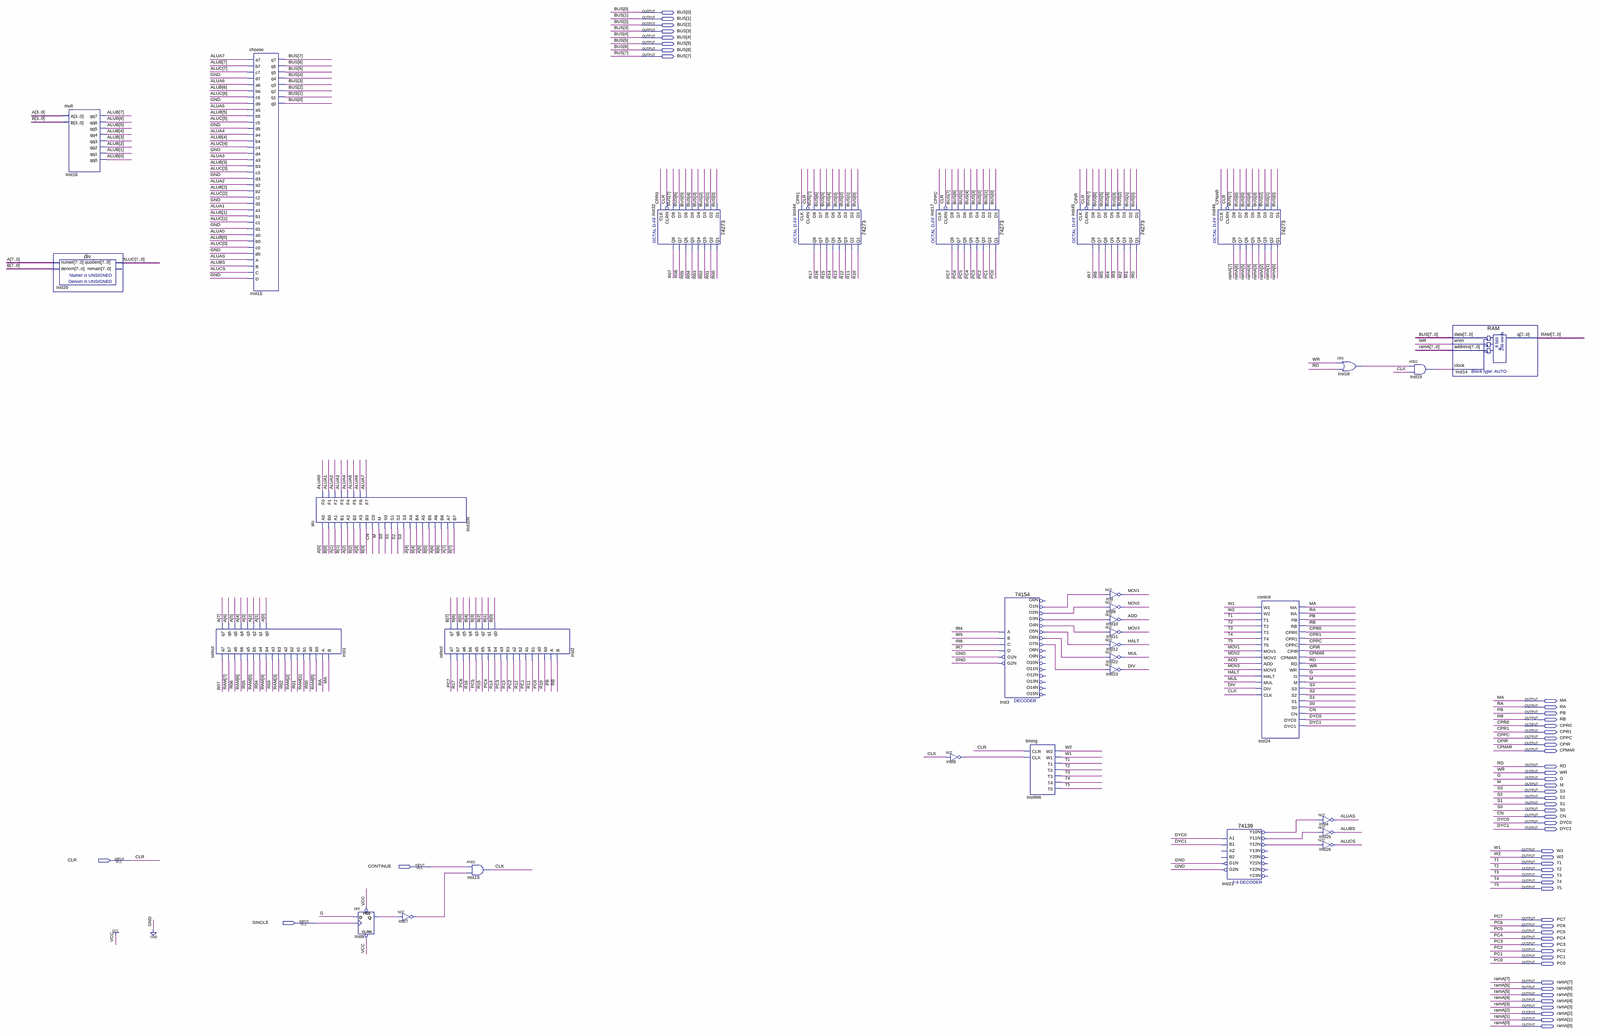
[diagram p0: schematic sheet, whole]
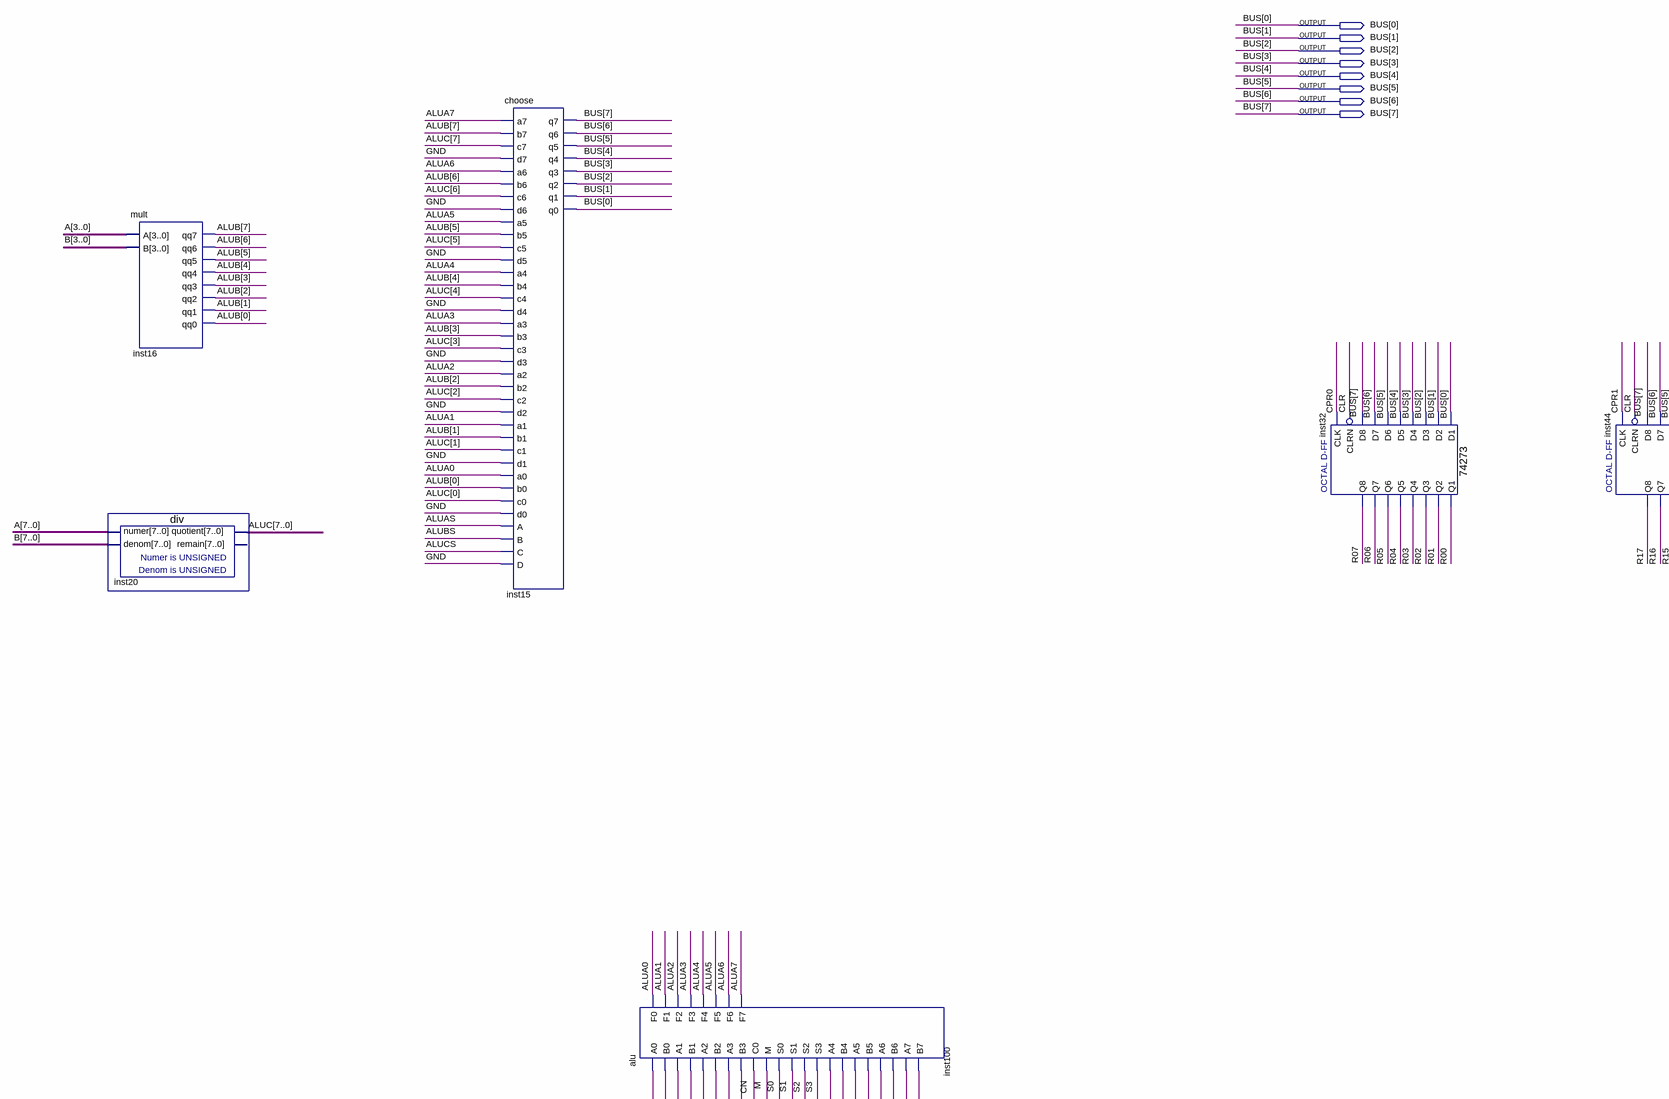
[diagram p1: schematic sheet, upper left part]
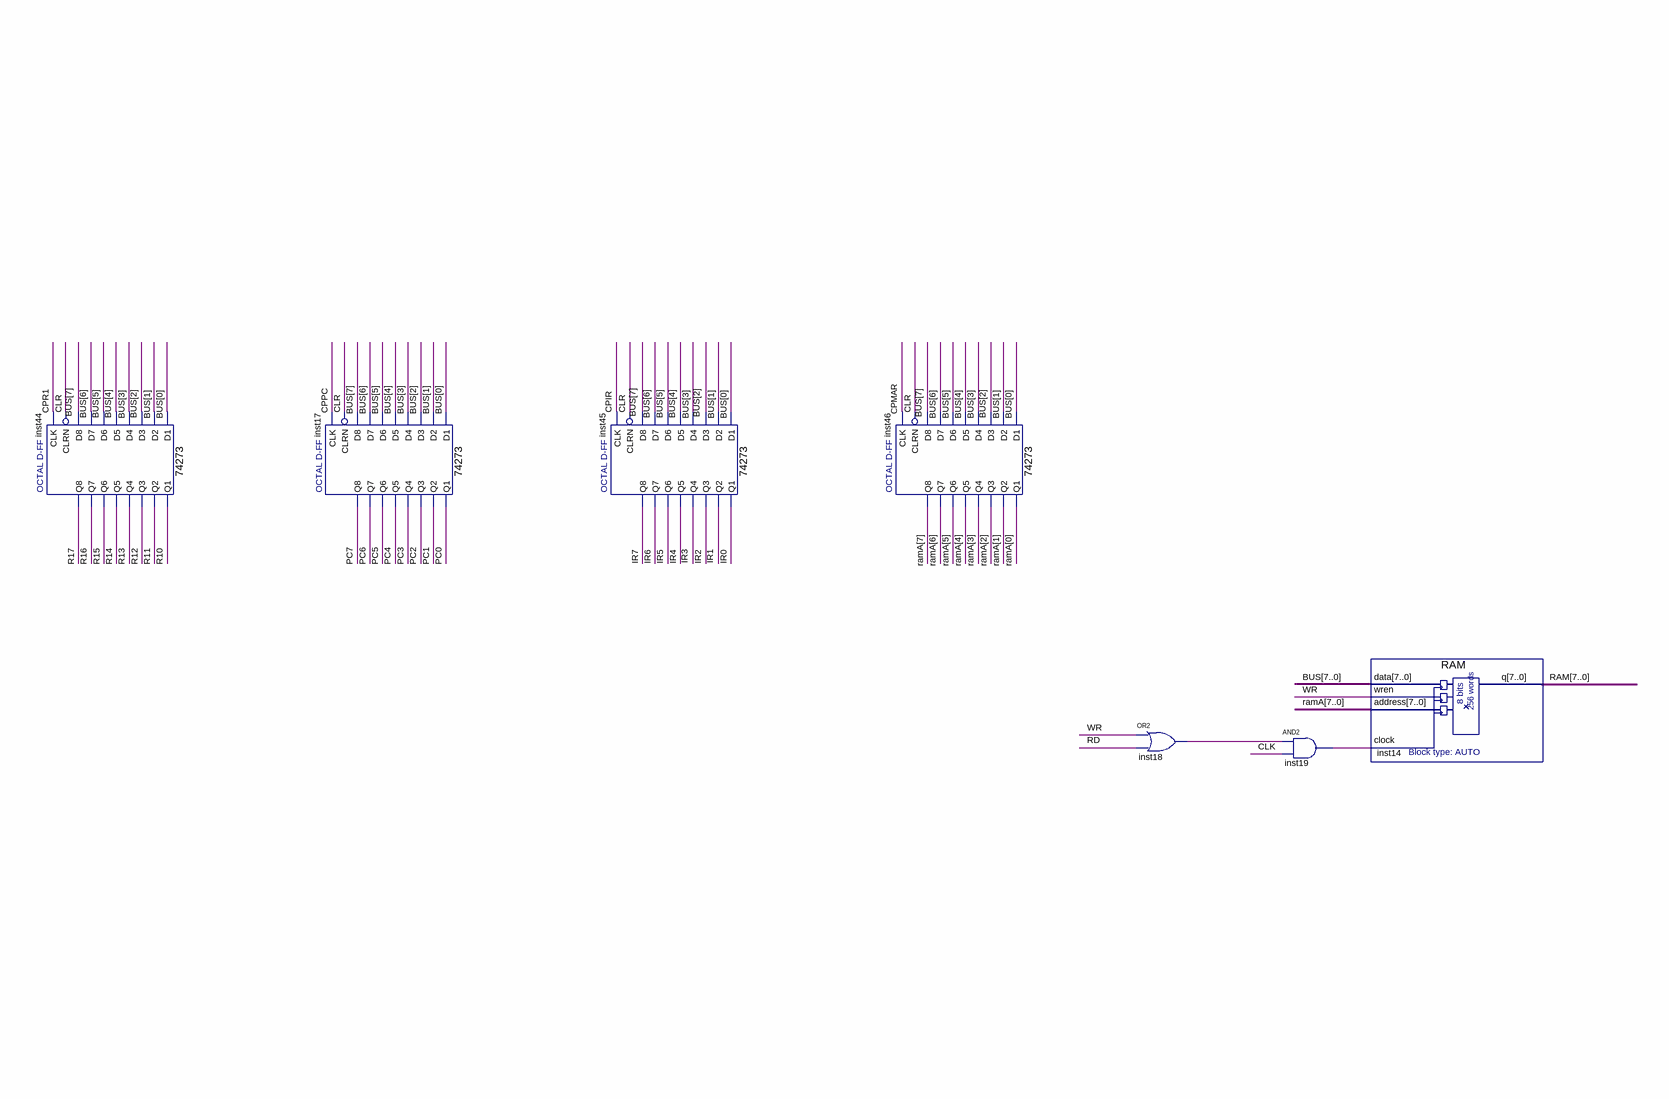
[diagram p2: schematic sheet, upper right part]
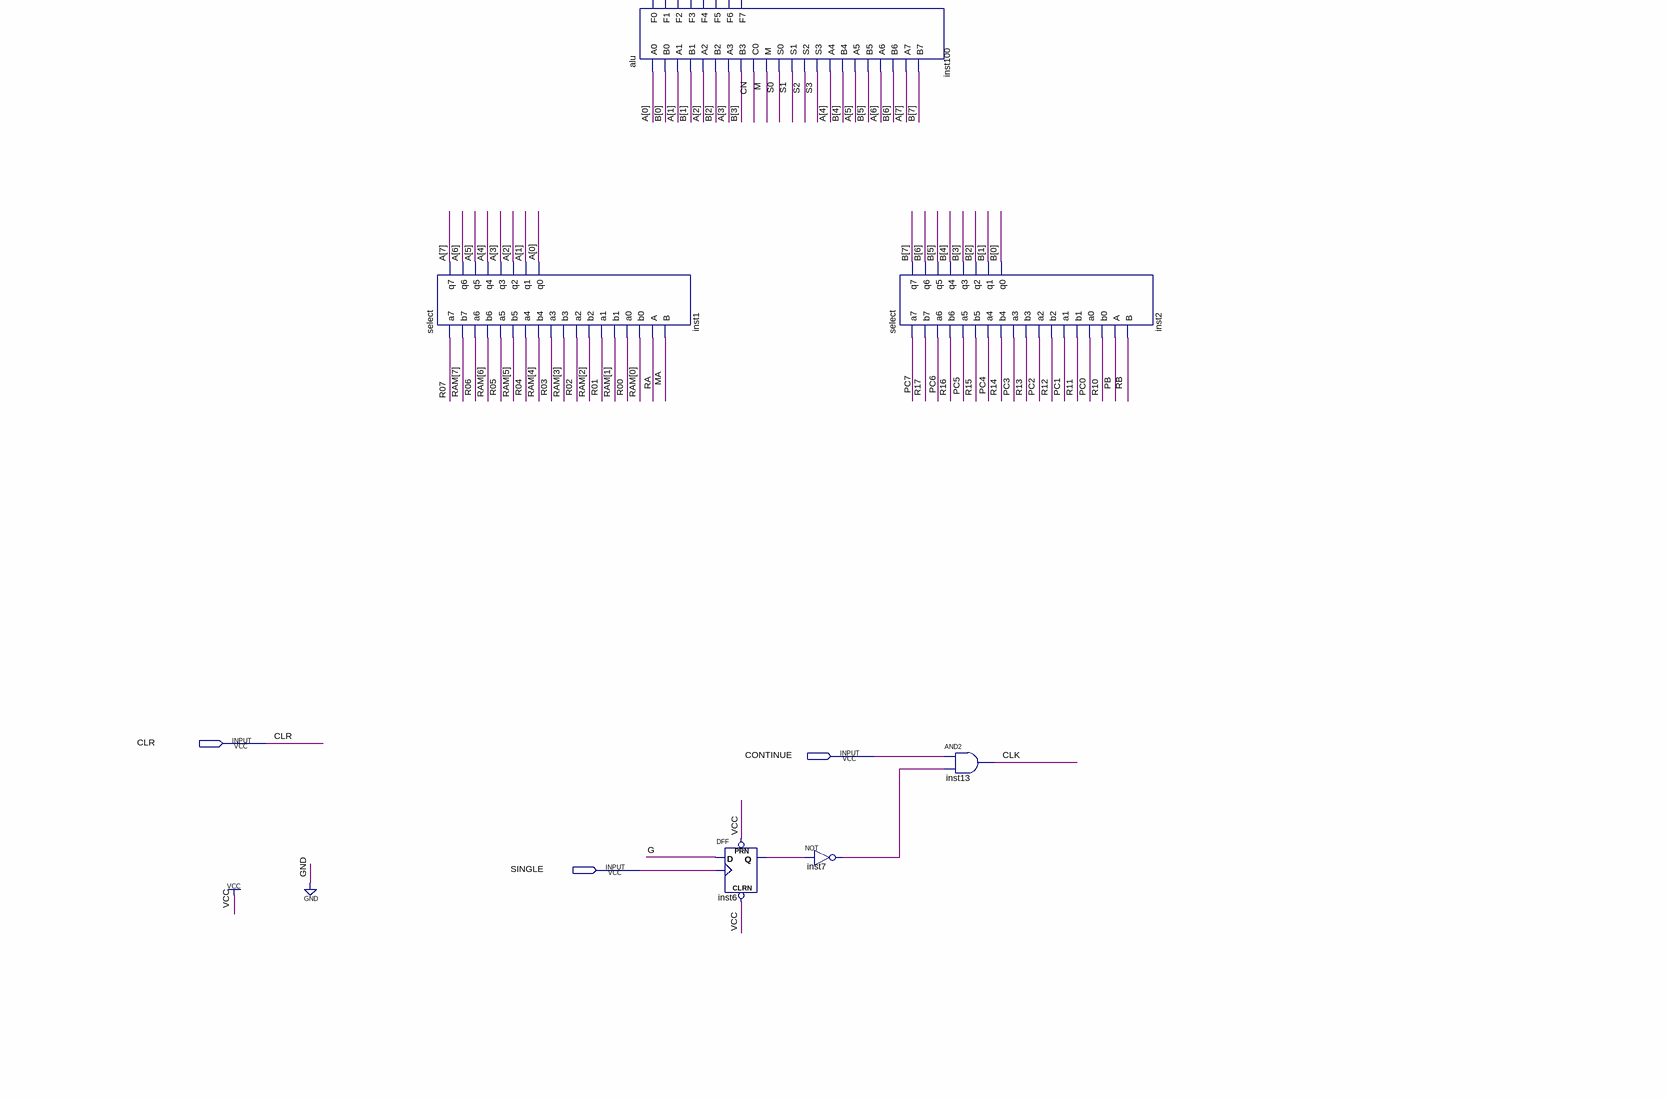
[diagram p3: schematic sheet, lower left part]
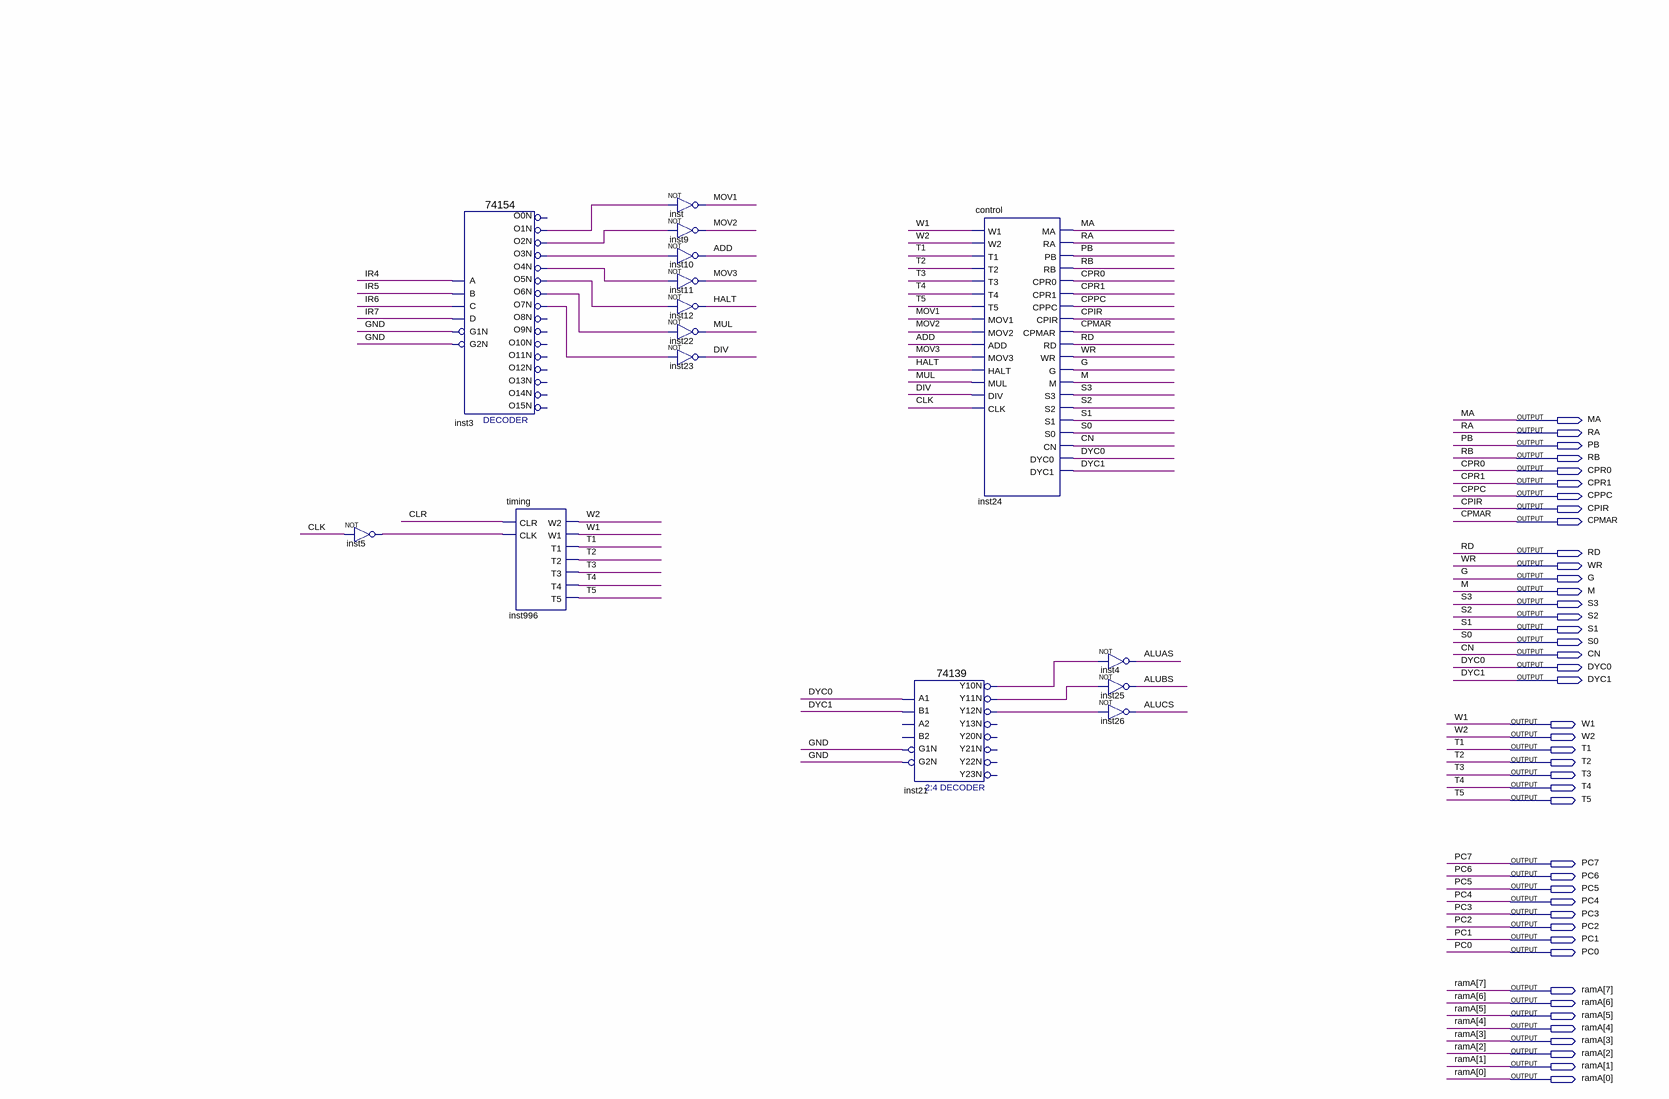
[diagram p4: schematic sheet, lower right part]
// Quartus schematic 4.bdf as structural Verilog: 32 symbols, 54 pins
module \4  (
  input  CLR,
  input  CONTINUE,
  input  SINGLE,
  output [7:0] BUS,
  output MA,
  output RA,
  output PB,
  output RB,
  output CPR0,
  output CPR1,
  output CPPC,
  output CPIR,
  output CPMAR,
  output RD,
  output WR,
  output G,
  output M,
  output S3,
  output S2,
  output S1,
  output S0,
  output CN,
  output DYC0,
  output DYC1,
  output W1,
  output W2,
  output T1,
  output T2,
  output T3,
  output T4,
  output T5,
  output PC7,
  output PC6,
  output PC5,
  output PC4,
  output PC3,
  output PC2,
  output PC1,
  output PC0,
  output [7:0] ramA
);

  wire ADD, ALUA0, ALUA1, ALUA2, ALUA3, ALUA4, ALUA5, ALUA6, ALUA7, ALUAS, ALUBS, ALUCS, CLK, DIV, HALT,
       inst3_o1n, inst3_o2n, inst3_o3n, inst3_o4n, inst3_o5n, inst3_o6n, inst3_o7n, inst5_out, inst6_q,
       inst7_out, inst18_out, inst19_out, inst21_y10n, inst21_y11n, inst21_y12n, IR0, IR1, IR2, IR3, IR4,
       IR5, IR6, IR7, MOV1, MOV2, MOV3, MUL, R00, R01, R02, R03, R04, R05, R06, R07, R10, R11, R12, R13, R14,
       R15, R16, R17;
  wire [7:0] A, ALUB, ALUC, B, RAM;

  mult inst16 (
    .A(A[3:0]), .B(B[3:0]), .qq7(ALUB[7]), .qq6(ALUB[6]), .qq5(ALUB[5]), .qq4(ALUB[4]), .qq3(ALUB[3]),
    .qq2(ALUB[2]), .qq1(ALUB[1]), .qq0(ALUB[0]));
  div inst20 (.numer(A), .denom(B), .quotient(ALUC));  // open: remain
  select inst1 (
    .a7(R07), .b7(RAM[7]), .a6(R06), .b6(RAM[6]), .a5(R05), .b5(RAM[5]), .a4(R04), .b4(RAM[4]), .a3(R03),
    .b3(RAM[3]), .a2(R02), .b2(RAM[2]), .a1(R01), .b1(RAM[1]), .a0(R00), .b0(RAM[0]), .A(RA), .B(MA),
    .q7(A[7]), .q6(A[6]), .q5(A[5]), .q4(A[4]), .q3(A[3]), .q2(A[2]), .q1(A[1]), .q0(A[0]));
  choose inst15 (
    .a7(ALUA7), .b7(ALUB[7]), .c7(ALUC[7]), .d7(1'b0), .a6(ALUA6), .b6(ALUB[6]), .c6(ALUC[6]), .d6(1'b0),
    .a5(ALUA5), .b5(ALUB[5]), .c5(ALUC[5]), .d5(1'b0), .a4(ALUA4), .b4(ALUB[4]), .c4(ALUC[4]), .d4(1'b0),
    .a3(ALUA3), .b3(ALUB[3]), .c3(ALUC[3]), .d3(1'b0), .a2(ALUA2), .b2(ALUB[2]), .c2(ALUC[2]), .d2(1'b0),
    .a1(ALUA1), .b1(ALUB[1]), .c1(ALUC[1]), .d1(1'b0), .a0(ALUA0), .b0(ALUB[0]), .c0(ALUC[0]), .d0(1'b0),
    .A(ALUAS), .B(ALUBS), .C(ALUCS), .D(1'b0), .q7(BUS[7]), .q6(BUS[6]), .q5(BUS[5]), .q4(BUS[4]),
    .q3(BUS[3]), .q2(BUS[2]), .q1(BUS[1]), .q0(BUS[0]));
  alu inst100 (
    .A0(A[0]), .B0(B[0]), .A1(A[1]), .B1(B[1]), .A2(A[2]), .B2(B[2]), .A3(A[3]), .B3(B[3]), .C0(CN), .M(M),
    .S0(S0), .S1(S1), .S2(S2), .S3(S3), .A4(A[4]), .B4(B[4]), .A5(A[5]), .B5(B[5]), .A6(A[6]), .B6(B[6]),
    .A7(A[7]), .B7(B[7]), .F0(ALUA0), .F1(ALUA1), .F2(ALUA2), .F3(ALUA3), .F4(ALUA4), .F5(ALUA5), .F6(ALUA6),
    .F7(ALUA7));
  DFF inst6 (.CLRN(1'b1), .CLK(SINGLE), .D(G), .PRN(1'b1), .Q(inst6_q));
  not inst7 (inst7_out, inst6_q);
  select inst2 (
    .a7(PC7), .b7(R17), .a6(PC6), .b6(R16), .a5(PC5), .b5(R15), .a4(PC4), .b4(R14), .a3(PC3), .b3(R13),
    .a2(PC2), .b2(R12), .a1(PC1), .b1(R11), .a0(PC0), .b0(R10), .A(PB), .B(RB), .q7(B[7]), .q6(B[6]),
    .q5(B[5]), .q4(B[4]), .q3(B[3]), .q2(B[2]), .q1(B[1]), .q0(B[0]));
  and inst13 (CLK, CONTINUE, inst7_out);
  \74273  inst32 (
    .D2(BUS[1]), .D3(BUS[2]), .D1(BUS[0]), .D4(BUS[3]), .D7(BUS[6]), .D6(BUS[5]), .D5(BUS[4]), .D8(BUS[7]),
    .CLK(CPR0), .CLRN(CLR), .Q4(R03), .Q1(R00), .Q2(R01), .Q3(R02), .Q6(R05), .Q5(R04), .Q7(R06), .Q8(R07));
  \74273  inst44 (
    .D2(BUS[1]), .D3(BUS[2]), .D1(BUS[0]), .D4(BUS[3]), .D7(BUS[6]), .D6(BUS[5]), .D5(BUS[4]), .D8(BUS[7]),
    .CLK(CPR1), .CLRN(CLR), .Q4(R13), .Q1(R10), .Q2(R11), .Q3(R12), .Q6(R15), .Q5(R14), .Q7(R16), .Q8(R17));
  \74273  inst17 (
    .D2(BUS[1]), .D3(BUS[2]), .D1(BUS[0]), .D4(BUS[3]), .D7(BUS[6]), .D6(BUS[5]), .D5(BUS[4]), .D8(BUS[7]),
    .CLK(CPPC), .CLRN(CLR), .Q4(PC3), .Q1(PC0), .Q2(PC1), .Q3(PC2), .Q6(PC5), .Q5(PC4), .Q7(PC6), .Q8(PC7));
  not inst5 (inst5_out, CLK);
  \74154  inst3 (
    .C(IR6), .D(IR7), .B(IR5), .A(IR4), .G1N(1'b0), .G2N(1'b0), .O1N(inst3_o1n), .O4N(inst3_o4n),
    .O3N(inst3_o3n), .O2N(inst3_o2n), .O7N(inst3_o7n), .O6N(inst3_o6n), .O5N(inst3_o5n));  // open: O0N, O12N, O15N, O10N, O11N, O13N, O14N, O9N, O8N
  timing inst996 (.CLR(CLR), .CLK(inst5_out), .W2(W2), .W1(W1), .T1(T1), .T2(T2), .T3(T3), .T4(T4), .T5(T5));
  \74273  inst45 (
    .D2(BUS[1]), .D3(BUS[2]), .D1(BUS[0]), .D4(BUS[3]), .D7(BUS[6]), .D6(BUS[5]), .D5(BUS[4]), .D8(BUS[7]),
    .CLK(CPIR), .CLRN(CLR), .Q4(IR3), .Q1(IR0), .Q2(IR1), .Q3(IR2), .Q6(IR5), .Q5(IR4), .Q7(IR6), .Q8(IR7));
  not inst (MOV1, inst3_o1n);
  not inst9 (MOV2, inst3_o2n);
  not inst10 (ADD, inst3_o3n);
  not inst11 (MOV3, inst3_o4n);
  not inst12 (HALT, inst3_o5n);
  not inst22 (MUL, inst3_o6n);
  not inst23 (DIV, inst3_o7n);
  \74273  inst46 (
    .D2(BUS[1]), .D3(BUS[2]), .D1(BUS[0]), .D4(BUS[3]), .D7(BUS[6]), .D6(BUS[5]), .D5(BUS[4]), .D8(BUS[7]),
    .CLK(CPMAR), .CLRN(CLR), .Q4(ramA[3]), .Q1(ramA[0]), .Q2(ramA[1]), .Q3(ramA[2]), .Q6(ramA[5]),
    .Q5(ramA[4]), .Q7(ramA[6]), .Q8(ramA[7]));
  \74139  inst21 (
    .A1(DYC0), .B1(DYC1), .G1N(1'b0), .G2N(1'b0), .Y10N(inst21_y10n), .Y12N(inst21_y12n), .Y11N(inst21_y11n));  // open: A2, B2, Y20N, Y13N, Y21N, Y22N, Y23N
  control inst24 (
    .W1(W1), .W2(W2), .T1(T1), .T2(T2), .T3(T3), .T4(T4), .T5(T5), .MOV1(MOV1), .MOV2(MOV2), .ADD(ADD),
    .MOV3(MOV3), .HALT(HALT), .MUL(MUL), .DIV(DIV), .CLK(CLK), .MA(MA), .RA(RA), .PB(PB), .RB(RB),
    .CPR0(CPR0), .CPR1(CPR1), .CPPC(CPPC), .CPIR(CPIR), .CPMAR(CPMAR), .RD(RD), .WR(WR), .G(G), .M(M),
    .S3(S3), .S2(S2), .S1(S1), .S0(S0), .CN(CN), .DYC0(DYC0), .DYC1(DYC1));
  or inst18 (inst18_out, WR, RD);
  not inst4 (ALUAS, inst21_y10n);
  not inst25 (ALUBS, inst21_y11n);
  not inst26 (ALUCS, inst21_y12n);
  and inst19 (inst19_out, inst18_out, CLK);
  RAM inst14 (.data(BUS), .wren(WR), .address(ramA), .clock(inst19_out), .q(RAM));
endmodule
